# EAGLE schematic Main_Board_v6 (EAGLE 9.7.0)
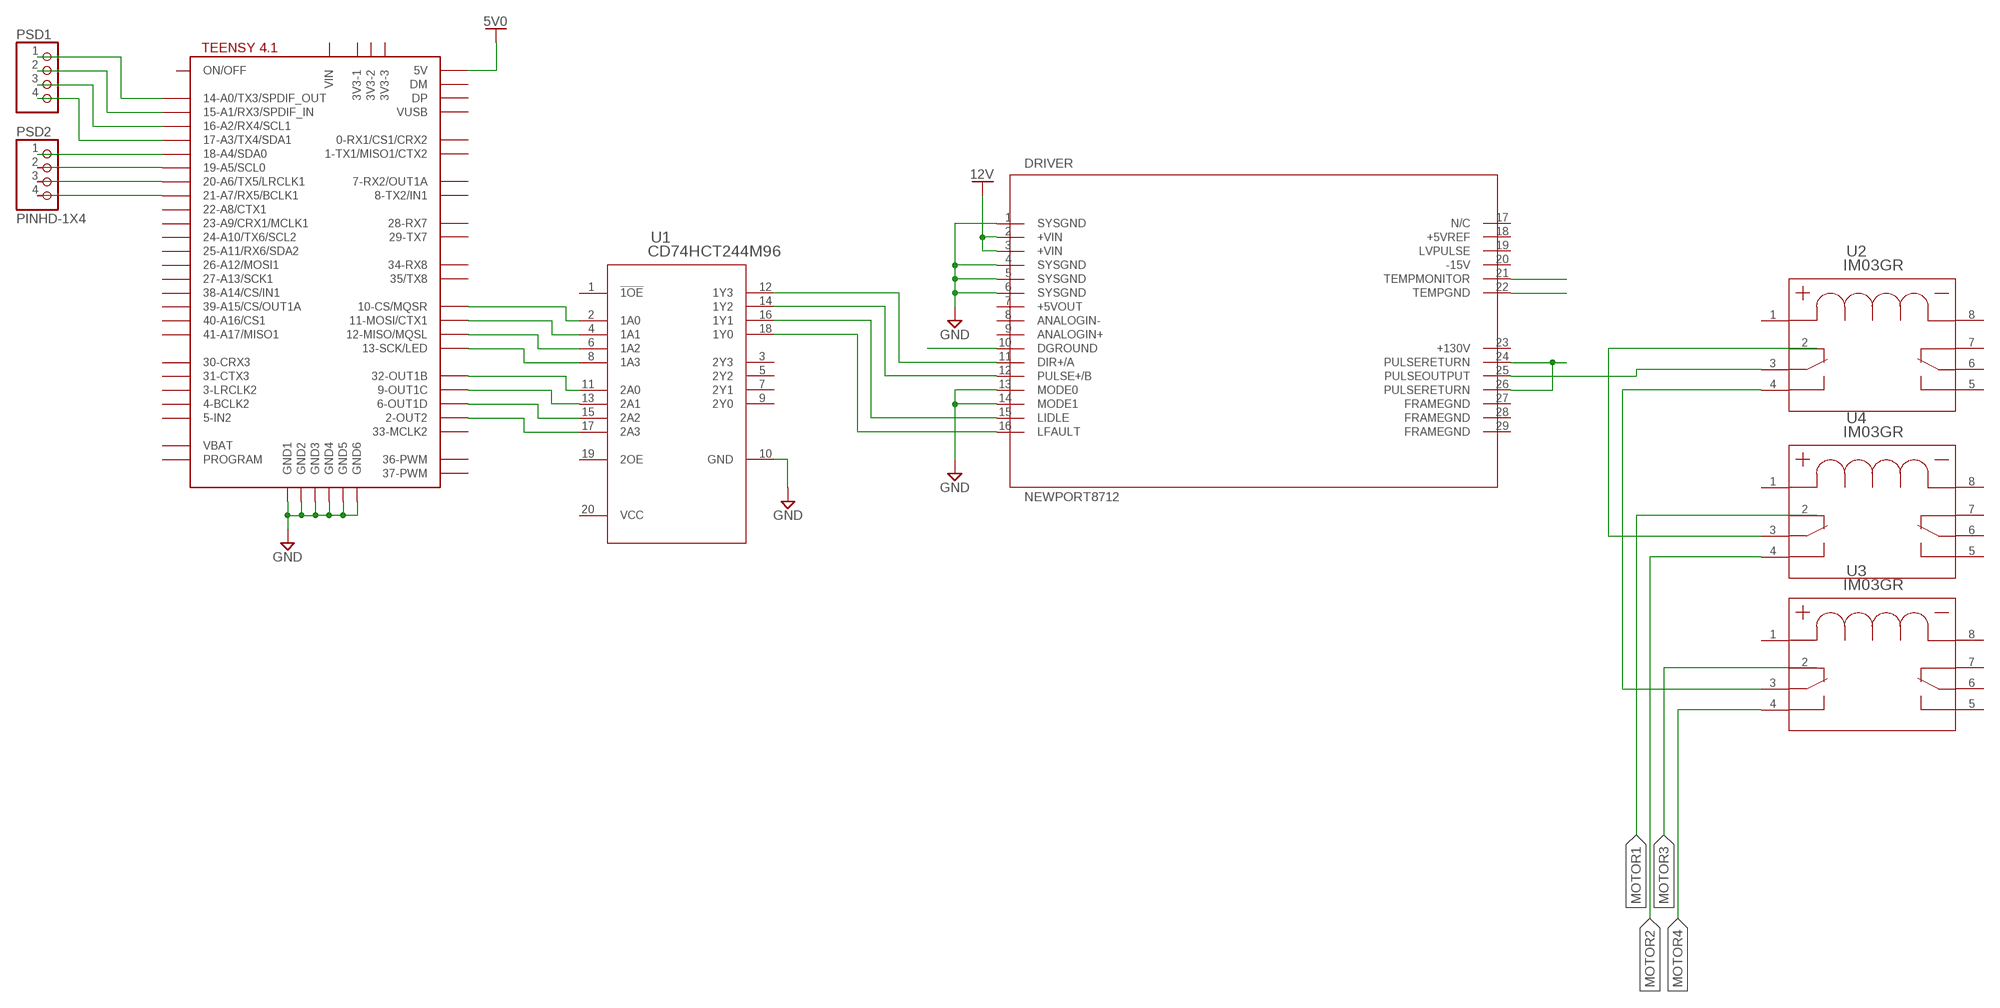
[diagram p0: schematic, sheet 1]

## Parts
DRIVER  NEWPORT8712  [NEWPORT8712]
PSD1  PINHD-1X4  [1X04]
PSD2  PINHD-1X4  [1X04]
U1  CD74HCT244M96  [DW20]
U2  IM03GR  [RELAY8-239X396_230]
U3  IM03GR  [RELAY8-239X396_230]
U4  IM03GR  [RELAY8-239X396_230]
U$2  TEENSY41-E  [TENNSY41-E]

## Nets
5V0: U$2.+5V(5V)
12V: DRIVER.2(+VIN) DRIVER.3(+VIN)
GND: DRIVER.1(SYSGND) DRIVER.4(SYSGND) DRIVER.5(SYSGND) DRIVER.6(SYSGND) DRIVER.13(MODE0) DRIVER.14(MODE1) U1.10(GND) U$2.GND1 U$2.GND2 U$2.GND3 U$2.GND4 U$2.GND5 U$2.GND6
MOTOR1: U4.2
MOTOR2: U4.4
MOTOR3: U3.2
MOTOR4: U3.4
N$1: PSD1.1 U$2.14-A0/TX3/SPDIF_OUT
N$2: PSD1.2 U$2.15-A1/RX3/SPDIF_IN
N$3: PSD1.3 U$2.16-A2/RX4/SCL1
N$4: PSD1.4 U$2.17-A3/TX4/SDA1
N$5: PSD2.1 U$2.18-A4/SDA0
N$6: PSD2.2 U$2.19-A5/SCL0
N$7: PSD2.3 U$2.20-A6/TX5/LRCLK1
N$8: PSD2.4 U$2.21-A7/RX5/BCLK1
N$9: U1.2(1A0) U$2.10-CS\MQSR(10-CS/MQSR)
N$10: U1.4(1A1) U$2.11-MOSI/CTX1
N$11: U1.6(1A2) U$2.12-MISO/MQSL
N$12: U1.8(1A3) U$2.13-SCK/LED
N$13: DRIVER.10(DGROUND)
N$14: DRIVER.24(PULSERETURN) DRIVER.26(PULSERETURN)
N$15: DRIVER.25(PULSEOUTPUT) U2.3
N$16: DRIVER.21(TEMPMONITOR)
N$17: DRIVER.22(TEMPGND)
N$18: U1.11(2A0) U$2.32-OUT1B
N$19: U1.13(2A1) U$2.9-OUT1C
N$20: U1.15(2A2) U$2.6-OUT1D
N$21: U1.17(2A3) U$2.2-OUT2
N$22: DRIVER.11(DIR+/A) U1.12(1Y3)
N$23: DRIVER.12(PULSE+/B) U1.14(1Y2)
N$24: DRIVER.15(LIDLE) U1.16(1Y1)
N$25: DRIVER.16(LFAULT) U1.18(1Y0)
N$26: U2.2 U4.3
N$27: U2.4 U3.3
Unconnected: DRIVER.7(+5VOUT) DRIVER.8(ANALOGIN-) DRIVER.9(ANALOGIN+) DRIVER.17(N/C) DRIVER.18(+5VREF) DRIVER.19(LVPULSE) DRIVER.20(-15V) DRIVER.23(+130V) DRIVER.27(FRAMEGND) DRIVER.28(FRAMEGND) DRIVER.29(FRAMEGND) U1.1(!1OE) U1.3(2Y3) U1.5(2Y2) U1.7(2Y1) U1.9(2Y0) U1.19(2OE) U2.1 U2.5 U2.6 U2.7 U2.8 U3.1 U3.5 U3.6 U3.7 U3.8 U4.1 U4.5 U4.6 U4.7 U4.8 U$2.0-RX1/CS1/CRX2 U$2.1-TX1/MISO1/CTX2 U$2.3-LRCLK2 U$2.3V3-1 U$2.3V3-2 U$2.3V3-3 U$2.4-BCLK2 U$2.5-IN2 U$2.7-RX2/OUT1A U$2.8-TX2/IN1 U$2.22-A8/CTX1 U$2.23-A9/CRX1/MCLK1 U$2.24-A10/TX6/SCL2 U$2.25-A11/RX6/SDA2 U$2.26-A12/MOSI1 U$2.27-A13/SCK1 U$2.28-RX7 U$2.29-TX7 U$2.30-CRX3 U$2.31-CTX3 U$2.33-MCLK2 U$2.34-RX8 U$2.35-TX8(35/TX8) U$2.36-PWM U$2.37-PWM U$2.38-A14/CS/IN1 U$2.39-A15/CS/OUT1A U$2.40-A16/CS1 U$2.41-A17/MISO1 U$2.DM U$2.DP U$2.ON/OFF U$2.PROGRAM U$2.VBAT U$2.VIN U$2.VUSB

## Power pins joined to a net without a drawn wire
VCC: U1.20(VCC)

## Library data of the parts
DRIVER = Newport 8712:NEWPORT8712
PSD1 PSD2 = Connector:PINHD-1X4: PIN HEADER; CATEGORY: CONNECTOR; SUB-CATEGORY: PIN-HEADER
U1 = CD74HCT244:CD74HCT244M96; DATASHEET_URL: http://www.ti.com/lit/gpn/CD74HCT244; DESCRIPTION: High Speed CMOS Logic Non-Inverting Octal Buffer/Line Drivers with 3-State Outputs; FAMILY_NAME: NON-INVERTING BUFFER/DRIVER; GENERIC_PART_NUMBER: CD74HCT244; INDUSTRY_STD_PKG_TYPE: SOIC; MANUFACTURER: Texas Instruments; PACKAGE_DESIGNATOR: DW; PIN_COUNT: 20
U2-U4 = IM03GR:IM03GR; BUILT_BY: EMA_UL_Team; COPYRIGHT: Copyright (C) 2016 Accelerated Designs. All rights reserved; MANUFACTURER_PART_NUMBER: IM03GR; SOURCELIBRARY: Tyco_2012-1-03; VENDOR: TE Connectivity
U$2 = teensy:TEENSY41-E